# Altium schematic sheet Power Muxing.SchDoc
size A4; SheetNumber: 6; SheetTotal: 6
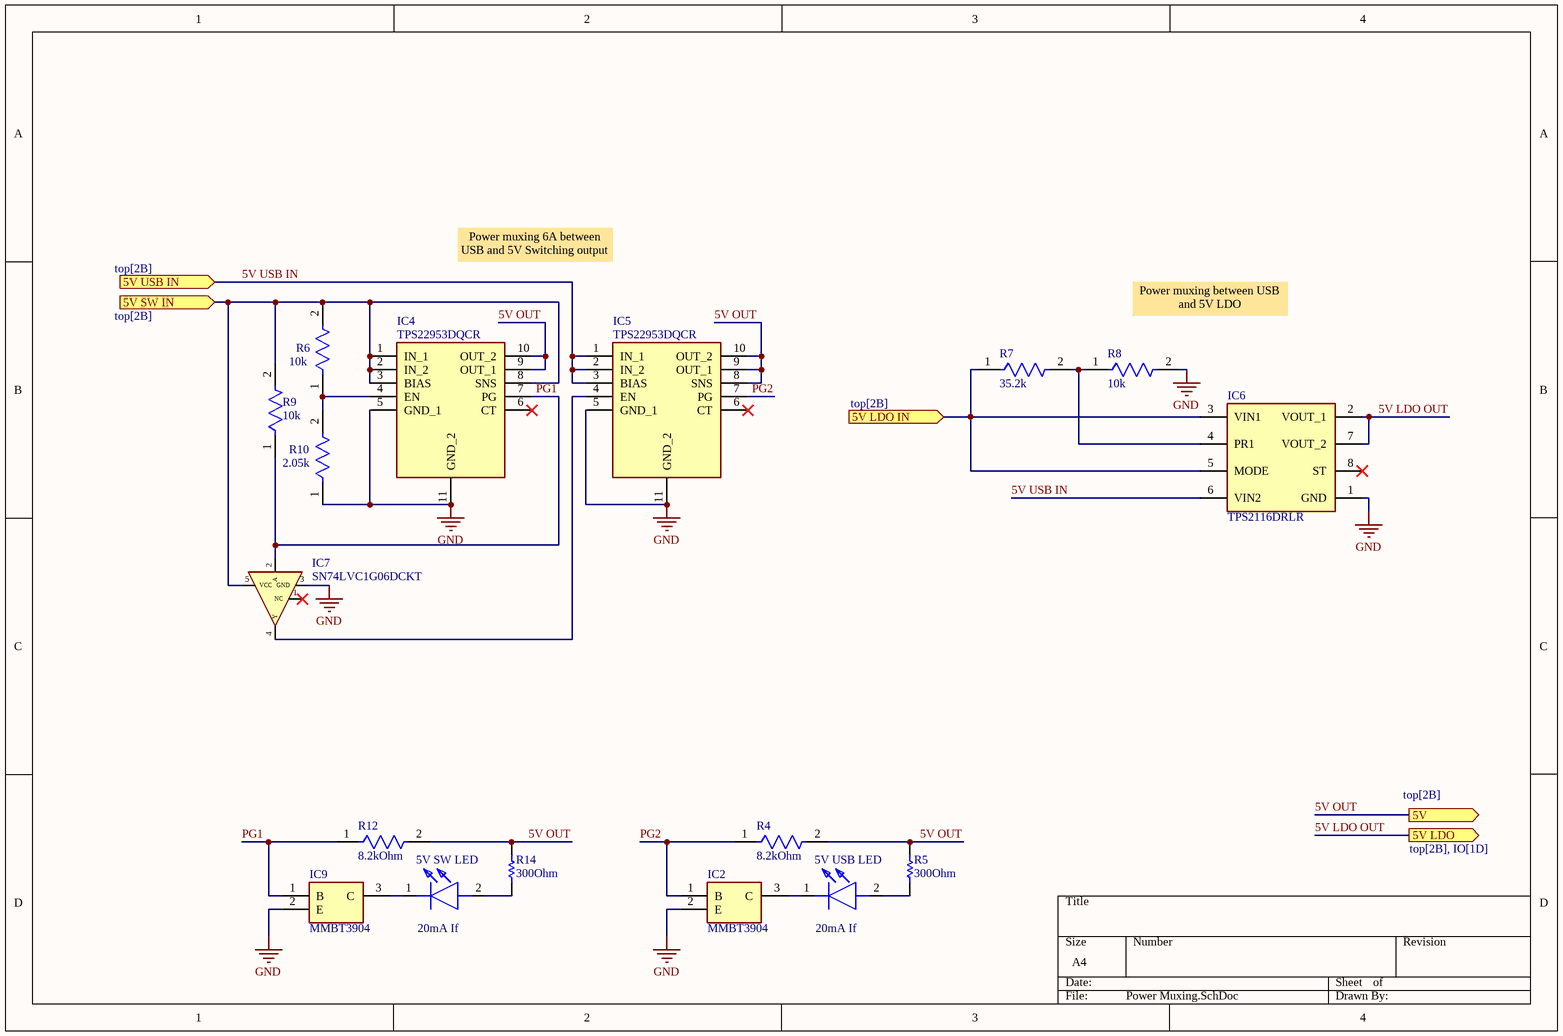
[diagram p0: Power Muxing.SchDoc]

## Parts
5V_SW_LED  20mA If  [KGEELP4122PHRH35A8J820R18]
5V_USB_LED  20mA If  [KGEELP4122PHRH35A8J820R18]
IC2  MMBT3904  [SOT95P240X120-3N]
IC4  TPS22953DQCR  [SON50P200X300X80-11N]
IC5  TPS22953DQCR  [SON50P200X300X80-11N]
IC6  TPS2116DRLR  [8PIN-SOT-5x3]
IC7  SN74LVC1G06DCKT  [5PIN-SC70]
IC9  MMBT3904  [SOT95P240X120-3N]
R4  8.2kOhm  [FP-RC0603-0_55-MFG]
R5  300Ohm  [RESC1608X55X30LL20T20]
R6  10k  [FP-AF0603-MFG]
R7  35.2k  [FP-RC0603-0_55-IPC_A]
R8  10k  [FP-RC0603-0_55-IPC_C]
R9  10k  [FP-AF0603-MFG]
R10  2.05k  [FP-AF0603-MFG]
R12  8.2kOhm  [FP-RC0603-0_55-MFG]
R14  300Ohm  [RESC1608X55X30LL20T20]

## Ports
5V (out, see top[2B]), 5V LDO (out, see top[2B], IO[1D]), 5V LDO IN (in, see top[2B]), 5V SW IN (in, see top[2B]), 5V USB IN (in, see top[2B])

## Nets
GND: IC2.2(E) IC4.5(GND_1) IC4.11(GND_2) IC5.5(GND_1) IC5.11(GND_2) IC6.1(GND) IC7.3(GND) IC9.2(E) R8.2 R10.1
5V LDO IN: IC6.3(VIN1) IC6.5(MODE) R7.1 ; port 5V LDO IN
5V LDO OUT: IC6.2(VOUT_1) IC6.7(VOUT_2) ; port 5V LDO
5V OUT: IC4.9(OUT_1) IC4.10(OUT_2) IC5.8(SNS) IC5.9(OUT_1) IC5.10(OUT_2) R4.2 R5.2 R12.2 R14.2 ; port 5V
5V SW IN: IC4.1(IN_1) IC4.2(IN_2) IC4.3(BIAS) IC4.8(SNS) IC7.5(VCC) R6.2 R9.2 ; port 5V SW IN
5V USB IN: IC5.1(IN_1) IC5.2(IN_2) IC5.3(BIAS) IC6.6(VIN2) ; port 5V USB IN
PG1: IC4.7(PG) IC7.2(A) IC9.1(B) R9.1 R12.1
PG2: IC2.1(B) IC5.7(PG) R4.1
Net5V_SW_LED_1: 5V_SW_LED.1(K) IC9.3(C)
Net5V_SW_LED_2: 5V_SW_LED.2(A) R14.1
Net5V_USB_LED_1: 5V_USB_LED.1(K) IC2.3(C)
Net5V_USB_LED_2: 5V_USB_LED.2(A) R5.1
NetIC4_4: IC4.4(EN) R6.1 R10.2
NetIC5_4: IC5.4(EN) IC7.4(Y)
NetIC6_4: IC6.4(PR1) R7.2 R8.1

Not connected (* = marked no-connect by the designer): IC4 6(CT)*; IC5 6(CT)*; IC6 8(ST)*; IC7 1(NC)*

## Notes on the sheet
- Power muxing 6A between USB and 5V Switching output
- Power muxing between USB and 5V LDO

## Library data of the parts
5V_SW_LED 5V_USB_LED = KG_EELP41.22-PHRH-35-A8J8-20-R18: LED; Manufacturer_Name: ams OSRAM; Manufacturer_Part_Number: KG EELP41.22-PHRH-35-A8J8-20-R18; Datasheet Link: https://www.farnell.com/datasheets/4386962.pdf?_gl=1*1sj7xoj*_gcl_aw*R0NMLjE3Mzc3MDQxMzMuRUFJYUlRb2JDaE1JdjdQa2l1eU5pd01WV291REJ4MzJTQ3RhRUFBWUFpQUFFZ0xCUGZEX0J3RQ..*_gcl_au*OTQ1Mjk2NjYxLjE3MzU1NTg3NDQ.; Height: 0.5mm; Mouser Part Number: 720-P4122PHRH35A8J82; Mouser Price/Stock: https://www.mouser.co.uk/ProductDetail/ams-OSRAM/KG-EELP41.22-PHRH-35-A8J8-20-R18?qs=ZcfC38r4Posajg8ZvCDQkg%3D%3D; Arrow Part Number: KG EELP41.22-PHRH-35-A8J8-20-R18; Arrow Price/Stock: https://www.arrow.com/en/products/kg-eelp41.22-phrh-35-a8j8-20-r18/ams-osram?utm_currency=USD&region=nac
IC2 IC9 = MMBT3904: Integrated Circuit; Manufacturer_Name: Diotec; Datasheet Link: https://media.digikey.com/pdf/Data%20Sheets/ON%20Semiconductor%20PDFs/2N3904,MMBT3904,PZT3904.pdf; Height: 1.2mm; Manufacturer_Part_Number: MMBT3904; Mouser Part Number: 637-MMBT3904; Mouser Price/Stock: https://www.mouser.co.uk/ProductDetail/Diotec-Semiconductor/MMBT3904?qs=OlC7AqGiEDkK1MwiyUU6mg%3D%3D; Arrow Part Number: MMBT3904; Arrow Price/Stock: https://www.arrow.com/en/products/mmbt3904/diotec-semiconductor-ag?utm_currency=USD&region=europe
IC4 IC5 = TPS22953DQCR: Integrated Circuit; Manufacturer_Name: Texas Instruments; Datasheet Link: https://www.ti.com/lit/ds/symlink/tps22953.pdf?ts=1619606232254&ref_url=https%253A%252F%252Fwww.ti.com%252Fstore%252Fti%252Fen%252Fp%252Fproduct%252F%253Fp%253DTPS22953DQCR; Height: 0.8mm; Manufacturer_Part_Number: TPS22953DQCR; Mouser Part Number: 595-TPS22953DQCR; Mouser Price/Stock: https://www.mouser.co.uk/ProductDetail/Texas-Instruments/TPS22953DQCR?qs=lGsJEpdjMw2%2Fit%2FtgfzifQ%3D%3D; Arrow Part Number: TPS22953DQCR; Arrow Price/Stock: https://www.arrow.com/en/products/tps22953dqcr/texas-instruments?utm_currency=USD&region=nac
IC6 = TPS2116DRLR: Integrated Circuit; Manufacturer_Name: Texas Instruments; Datasheet Link: https://www.ti.com/lit/gpn/tps2116; Height: 0.6mm; Manufacturer_Part_Number: TPS2116DRLR; Mouser Part Number: 595-TPS2116DRLR; Mouser Price/Stock: https://www.mouser.co.uk/ProductDetail/Texas-Instruments/TPS2116DRLR?qs=aP1CjGhiNiGo3XAyXcVPaQ%3D%3D; Arrow Part Number: TPS2116DRLR; Arrow Price/Stock: https://www.arrow.com/en/products/tps2116drlr/texas-instruments?utm_currency=USD&region=nac
IC7 = SN74LVC1G06DCKT: Integrated Circuit; Manufacturer_Name: Texas Instruments; Datasheet Link: http://www.ti.com/lit/gpn/sn74lvc1g06; Height: 1.1mm; Manufacturer_Part_Number: SN74LVC1G06DCKT; Mouser Part Number: 595-SN74LVC1G06DCKT; Mouser Price/Stock: https://www.mouser.co.uk/ProductDetail/Texas-Instruments/SN74LVC1G06DCKT?qs=pajgIaoyDUgT6MJoS5pgkQ%3D%3D; Arrow Part Number: SN74LVC1G06DCKT; Arrow Price/Stock: https://www.arrow.com/en/products/sn74lvc1g06dckt/texas-instruments?region=nac
R4 R12 = CMP-1659-00040-2: NexarPartId: 40301092; Voltage Rating (AC): 50V; Resistance: 8.2kΩ; Power Rating: 100mW; Temperature Coefficient: 100ppm/°C; Tolerance: 1%; Number of Terminations: 2; Length: 1.6mm; Height: 450µm; Composition: Thick Film; Case Code (Imperial): 0603; Features: Moisture Resistant; Width: 800µm; Max Operating Temperature: 155°C; Lead Pitch: 300µm; Voltage Rating: 50V; Termination: SMD/SMT; Case Code (Metric): 1608; Max Power Dissipation: 100mW; REACH SVHC: No SVHC; Number of Pins: 2; Min Operating Temperature: -55°C; Case/Package: 0603; Packaging: Tape & Reel; Voltage Rating (DC): 50V; Schedule B: 8533210045, 8533210045; Lead Free: Lead Free; RoHS: Compliant; Military Standard: Not; Depth: 800µm
R5 R14 = CMP-2000-00025-1: Part Number: ERA3AEB301V; Manufacturer: Panasonic
R6 R9 = CMP-03412-049106-1: Anti-Sulfurated Chip Resistors Automotive Grade 10kΩ 1% 100ppm/°C 0603
R7 = RT0603BRD0735K2L: High Precision-High Stability Chip Resistor Thin Film 0603 35.2kOhm 0.1% Paper T/R; Manufacturer: Yageo; Value: 35.2kR; Temperature Coefficient: 25ppm/°C; Max Power Dissipation: 100mW; Supplier: Digikey; Supplier Part Number: 13-RT0603BRD0735K2LCT-ND; Manufacturer Part Number: RT0603BRD0735K2L; RoHS: Yes; Category: Chip SMD Resistors; Stock: 17147; Pricing: 1=0.1, 10=0.07, 25=0.0664, 50=0.0622, 100=0.0551, 250=0.05152, 500=0.04676, 1000=0.04432 (USD); Case/Package: 0603; Min Operating Temperature: -55°C; Max Operating Temperature: 155°C; Tolerance: 0.1%; Packaging: Tape and Reel; Number of Terminations: 2; Series: RT; RoHS Compliant: Yes; ComponentLink1URL: https://www.yageo.com/upload/media/product/productsearch/datasheet/rchip/PYu-RT_1-to-0.01_RoHS_L_12.pdf?src-supplier=Digikey; ComponentLink1Description: https://www.yageo.com/upload/media/product/productsearch/datasheet/rchip/PYu-RT_1-to-0.01_RoHS_L_12.pdf?src-supplier=Digikey
R8 = CMP-2100-03664-2: RES 10K OHM 1% 1/10W 0603; Voltage Rating: 75V; Voltage Rating (DC): 50V; Resistance: 10kR; Power Rating: 100mW; Temperature Coefficient: 100ppm/°C; Depth: 0.8mm; Termination: SMD/SMT; Resistor Type: Thick Film; Series: RC; Construction: Rectangular; Features: Moisture Resistant; Packaging: Tape and Reel; Min Operating Temperature: -55°C; Number of Terminations: 2; Lead Pitch: 0.3mm; RoHS Compliant: Yes; Case/Package: 0603; Resistance Tolerance: 1%; Military Standard: Not; Weight: 7.1E-05oz; Number of Pins: 2; Tolerance: 1%; Length: 1.6mm; Case Code (Imperial): 0603; Lead Free: Lead Free; Width: 0.8mm; Max Power Dissipation: 100mW; Height: 0.45mm; Max Operating Temperature: 155°C; Case Code (Metric): 1608; Size Code: 0603
R10 = CMP-03412-038269-1: Anti-Sulfurated Chip Resistors Automotive Grade 2.05kΩ 1% 100ppm/°C 0603; Power Rating: 100mW; Resistance: 2.05kR; Voltage Rating: 75V; Case Code (Metric): 1608; Termination: SMD/SMT; Series: AF; Resistor Type: Thick Film; Features: Moisture Resistant; Case/Package: 0603; Case Code (Imperial): 0603; Size Code: 0603; Height: 0.022inch; Number of Terminations: 2; Weight: 7.1E-05oz; Width: 0.8mm; Min Operating Temperature: -55°C; Package Quantity: 5000; Tolerance: 1%; RoHS Compliant: Yes; Packaging: Tape and Reel; Temperature Coefficient: 100ppm/°C; Max Power Dissipation: 100mW; Lead Free: Lead Free; Length: 0.063inch; Max Operating Temperature: 155°C